# Altium schematic sheet Sheet1.SchDoc
size Tabloid; SheetNumber: 1; SheetTotal: 1
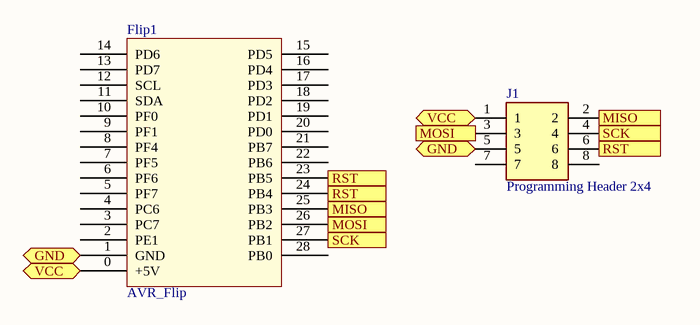
[diagram p0: Sheet1.SchDoc]

## Parts
Flip1  AVR_Flip  [AVR_Flip]
J1  Programming Header 2x4  [Connector 2x4]

## Ports
GND (bidir), MISO (in), MISO (out), MOSI (in), MOSI (out), RST (in), RST (out), SCK, SCK (out), VCC (bidir)

## Nets
GND: Flip1.1(GND) J1.5 ; port GND
MISO: Flip1.25(PB3) J1.2 ; port MISO
MOSI: Flip1.26(PB2) J1.3 ; port MOSI
RST: Flip1.23(PB5) Flip1.24(PB4) J1.6 ; port RST
SCK: Flip1.27(PB1) J1.4 ; port SCK
VCC: Flip1.0(+5V) J1.1 ; port VCC

Not connected (* = marked no-connect by the designer): Flip1 2(PE1) 3(PC7) 4(PC6) 5(PF7) 6(PF6) 7(PF5) 8(PF4) 9(PF1) 10(PF0) 11(SDA) 12(SCL) 13(PD7) 14(PD6) 15(PD5) 16(PD4) 17(PD3) 18(PD2) 19(PD1) 20(PD0) 21(PB7) 22(PB6) 28(PB0); J1 7 8

## Library data of the parts
J1 = Programming Header 2x4: Connector 1,27mm; Manufacturer_Name: Mill-Max; Manufacturer_Part_Number: 855-22-008-10-001101; Datasheet Link: https://componentsearchengine.com/Datasheets/2/855-22-008-10-001101.pdf; Height: 6.27mm; Mouser Part Number: 575-855-22-008-10; Mouser Price/Stock: https://www.mouser.co.uk/ProductDetail/Mill-Max/855-22-008-10-001101?qs=mPCt1EmoOdQMosTdRU7w4Q%3D%3D